# EAGLE design Day0_DafaFarisM_13215044 (EAGLE 7.6.0)
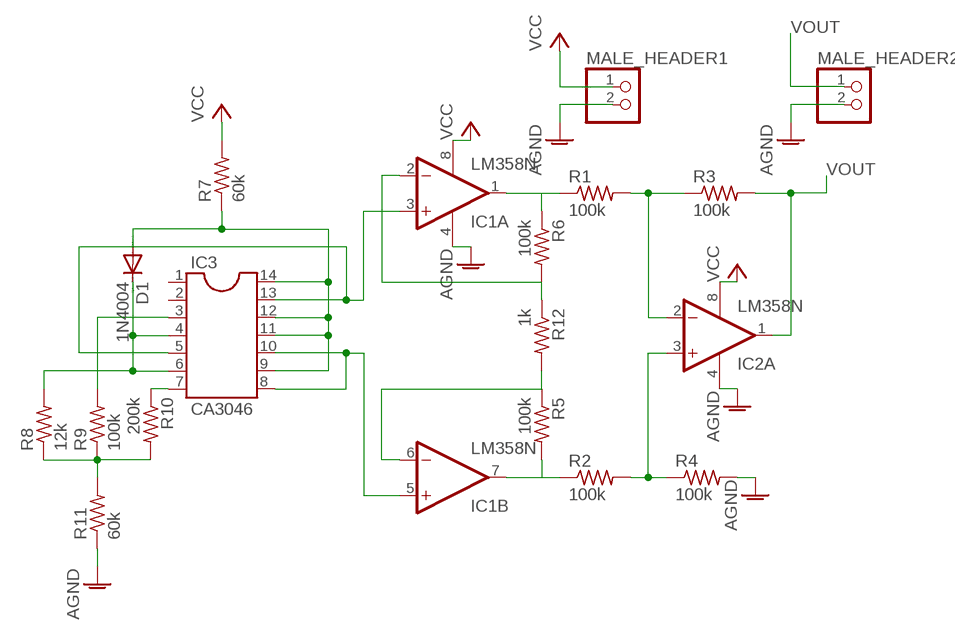
[diagram p0: schematic, sheet 1]

## Parts
D1  1N4004  [DO41-10]
IC1  LM358N  [DIL08]
IC2  LM358N  [DIL08]
IC3  CA3046  DIL14  [DIL14]
MALE_HEADER1  PINHD-1X2  [1X02]
MALE_HEADER2  PINHD-1X2  [1X02]
R1  100k  R-US_0204/2V  [0204V]
R2  100k  R-US_0204/2V  [0204V]
R3  100k  R-US_0204/2V  [0204V]
R4  100k  R-US_0204/2V  [0204V]
R5  100k  R-US_0204/2V  [0204V]
R6  100k  R-US_0204/2V  [0204V]
R7  60k  R-US_0204/2V  [0204V]
R8  12k  R-US_0204/2V  [0204V]
R9  100k  R-US_0204/2V  [0204V]
R10  200k  R-US_0204/2V  [0204V]
R11  60k  R-US_0204/2V  [0204V]
R12  1k  R-US_0204/2V  [0204V]

## Nets
AGND: IC1.4(P:V-) IC2.4(P:V-) MALE_HEADER1.2 MALE_HEADER2.2 R4.2 R11.1
N$1: D1.A IC3.9 IC3.11 IC3.12 IC3.14 R7.1
N$2: D1.C IC3.4 IC3.6 R8.2
N$3: IC3.7 R10.1
N$4: IC3.3 R9.2
N$5: IC1.3(A:+IN) IC3.5 IC3.13
N$6: IC1.5(B:+IN) IC3.8 IC3.10
N$7: R8.1 R9.1 R10.2 R11.2
N$8: IC1.2(A:-IN) R6.2 R12.1
N$9: IC1.1(A:OUT) R1.1 R6.1
N$10: IC2.2(A:-IN) R1.2 R3.1
N$11: IC1.6(B:-IN) R5.1 R12.2
N$13: IC1.7(B:OUT) R2.1 R5.2
N$14: IC2.3(A:+IN) R2.2 R4.1
VCC: IC1.8(P:V+) IC2.8(P:V+) MALE_HEADER1.1 R7.2
VOUT: IC2.1(A:OUT) MALE_HEADER2.1 R3.2
Unconnected: IC2.5(B:+IN) IC2.6(B:-IN) IC2.7(B:OUT) IC3.1 IC3.2

## Library data of the parts
D1 = diode:1N4004: DIODE general purpose rectifier, 1 A
IC1 IC2 = linear:LM358: OP AMP also LM158; LM258; LM2904 Source: http://cache.national.com/ds/LM/LM158.pdf
IC3 = ic-package:DIL14: Dual In Line / Socket
MALE_HEADER1 MALE_HEADER2 = pinhead:PINHD-1X2: PIN HEADER
R1-R12 = rcl:R-US_: RESISTOR, American symbol

## Board
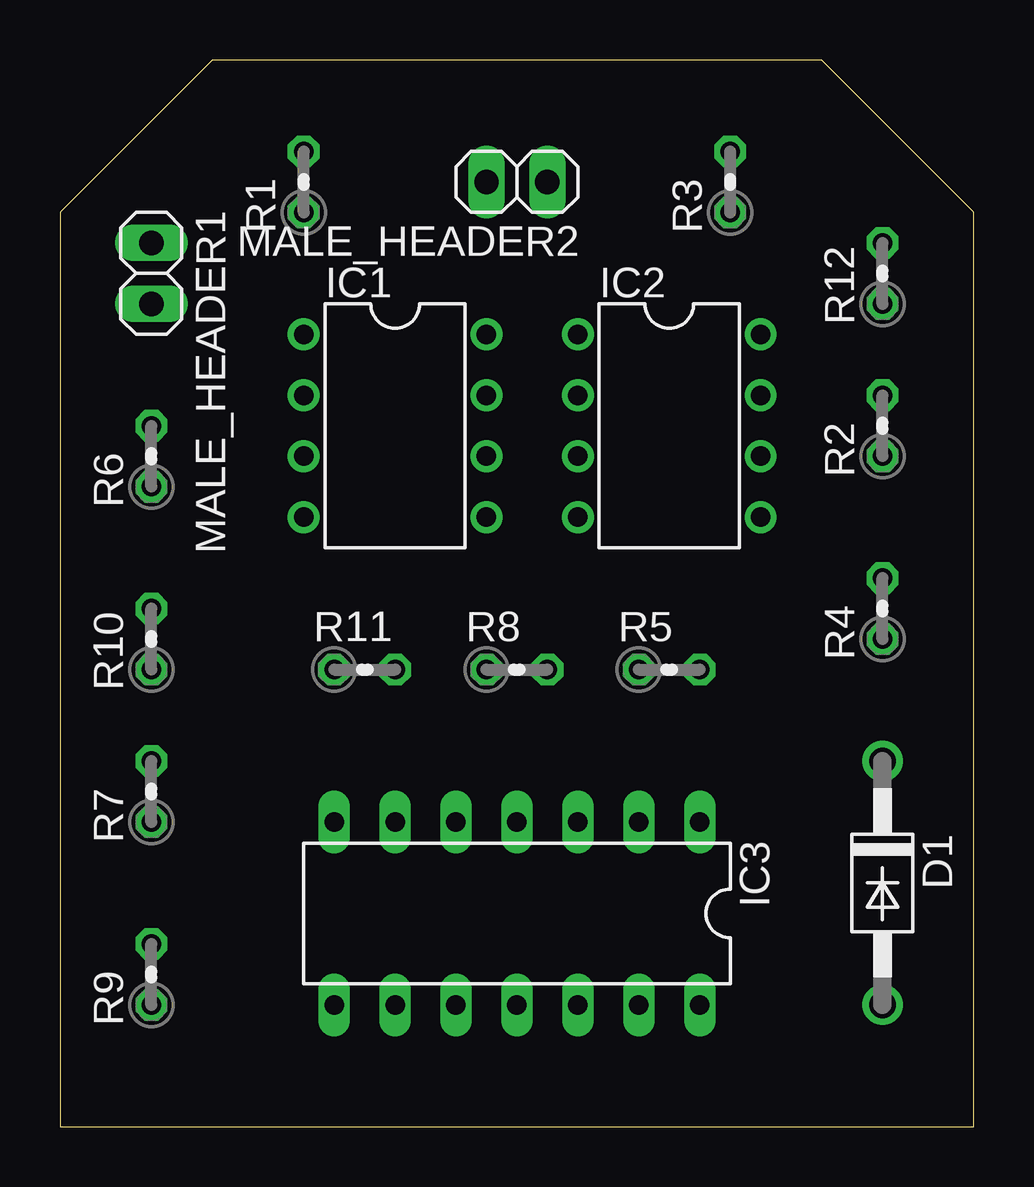
[diagram p1: board, top side]
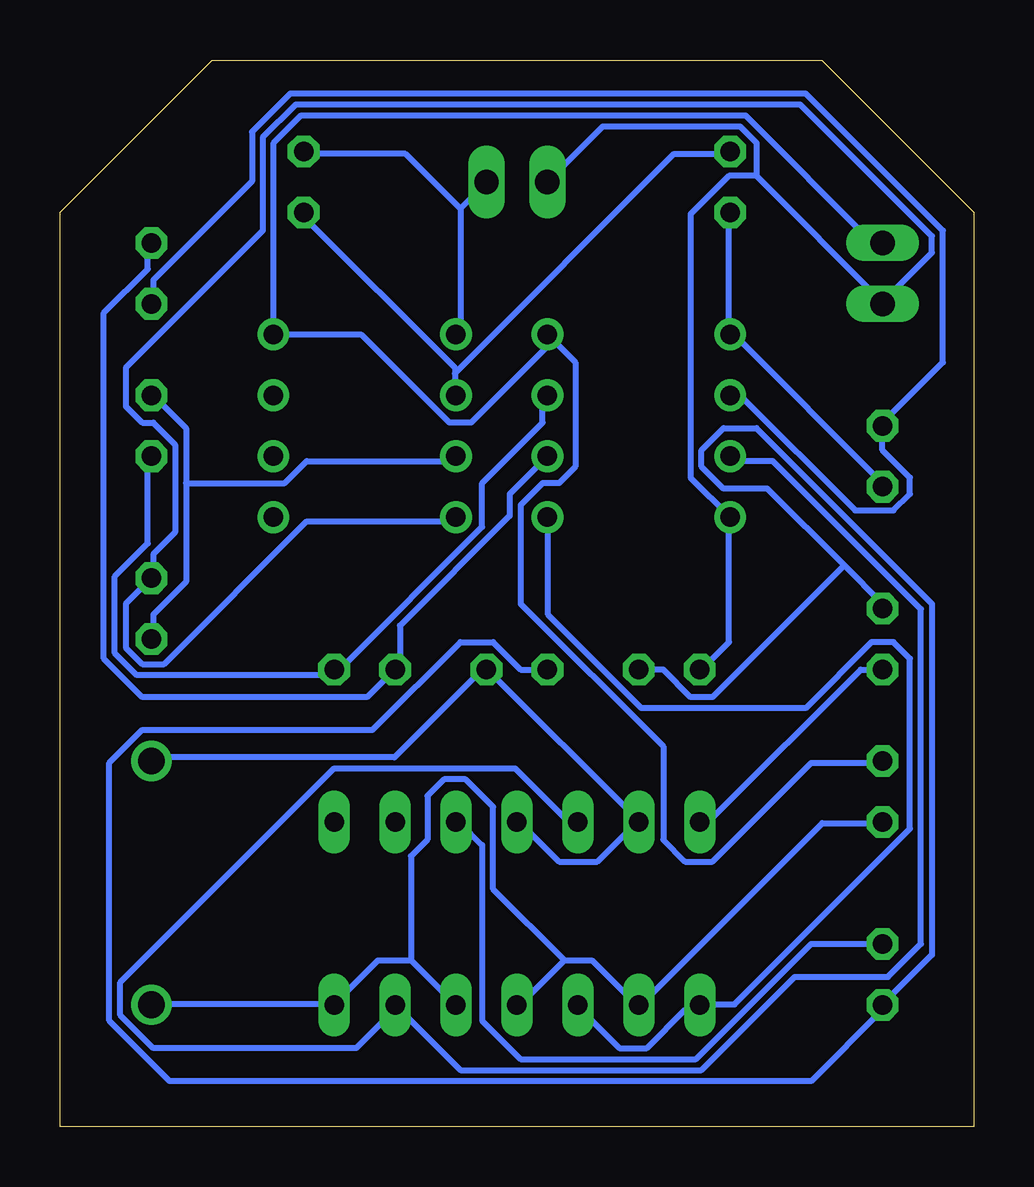
[diagram p2: board, bottom side, seen from below]

Size 38.1 x 44.45 mm. Coordinates in mm from the lower left corner, seen from the top.
Outline: 0,0 38.1,0 38.1,38.1 31.76,44.44 30.15,44.44 6.35,44.45 0,38.1 0,0
Copper layers (1*16): Top 0.035mm / dielectric 1.5mm / Bottom 0.035mm
Design rules "default": minimum track width 10mil, minimum drill 24mil, track to track 8mil, track to pad 8mil, pad to pad 8mil, via to via 8mil, smd to smd 8mil, copper to edge 40mil, drill to drill 8mil, minimum pad ring 10mil, minimum via ring 8mil, stop-mask expansion 4mil, vias tented up to drill 0mil, thermal gap 10mil

### Footprints (pad centres in the part's own frame; a part is rotated, then mirrored left to right if it is on the bottom)
DO41-10 = drill 1.118: A 5.08,0; C -5.08,0
DIL08 = drill 0.813 pad 1.27: 1 -3.81,-3.81; 2 -1.27,-3.81; 3 1.27,-3.81; 4 3.81,-3.81; 5 3.81,3.81; 6 1.27,3.81; 7 -1.27,3.81; 8 -3.81,3.81
DIL14 = drill 0.813 long: 1 -7.62,-3.81; 2 -5.08,-3.81; 3 -2.54,-3.81; 4 0,-3.81; 5 2.54,-3.81; 6 5.08,-3.81; 7 7.62,-3.81; 8 7.62,3.81; 9 5.08,3.81; 10 2.54,3.81; 11 0,3.81; 12 -2.54,3.81; 13 -5.08,3.81; 14 -7.62,3.81
1X02 = drill 1.016 long: 1 -1.27,0; 2 1.27,0
0204V = drill 0.813 octagon: 1 -1.27,0; 2 1.27,0

### Placement (x,y rotation side)
D1  34.29,10.16 270 top
IC1  13.97,29.21 270 top
IC2  25.4,29.21 270 top
IC3  19.05,8.89 180 top
MALE_HEADER1  3.81,35.56 270 top
MALE_HEADER2  19.05,39.37 180 top
R1  10.16,39.37 90 top
R2  34.29,29.21 90 top
R3  27.94,39.37 90 top
R4  34.29,21.59 90 top
R5  25.4,19.05 0 top
R6  3.81,27.94 90 top
R7  3.81,13.97 90 top
R8  19.05,19.05 0 top
R9  3.81,6.35 90 top
R10  3.81,20.32 90 top
R11  12.7,19.05 0 top
R12  34.29,35.56 90 top

### Tracks (layer width: path | path; a pad name or v marks a point on that pad's centre or on a via)
AGND
  Bottom 0.254: IC2.4 21.64,25.22 27.81,25.22 33.76,19.28 34.67,19.28 35.36,19.96 35.36,21.79 R4.2 34.21,22.94 34.21,23.85 33.3,24.77 33.3,28.42 34.21,29.34 34.67,29.34 35.36,30.02 35.36,31.62 29.64,37.34 29.64,41.22 28.27,42.6 7.24,42.6 1.75,37.11 1.75,36.42 3.81,34.37 | R11.1 11.35,19.05 10.21,20.19 10.21,25.22 IC1.4 11.81,27.05 11.81,38.02 10.21,39.62 9.07,39.62 | 9.07,39.62 3.81,34.37 | 9.07,39.62 9.07,41 9.75,41.68 15.47,41.68 MALE_HEADER2.2 | 3.81,34.37 MALE_HEADER1.2
N$1
  Bottom 0.254: 23.47,6.93 21.64,5.1 IC3.12 | 23.47,6.93 24.84,6.93 26.67,5.1 | 26.67,5.1 34.21,5.1 D1.A | 26.67,5.1 IC3.14 | 17.07,6.93 15.93,6.93 14.1,5.1 IC3.9 13.87,5.1 6.32,12.65 3.81,12.65 R7.1 | 17.07,6.93 18.9,5.1 IC3.11 | 23.47,6.93 23.47,11.28 22.78,11.96 22.78,13.79 22.1,14.48 21.18,14.48 20.04,13.33 20.04,9.91 17.07,6.93
N$2
  Bottom 0.254: IC3.4 18.9,12.65 17.3,11.05 15.7,11.05 14.1,12.65 IC3.6 14.1,12.88 20.27,19.05 R8.2 20.5,19.05 24.15,15.39 34.21,15.39 D1.C
N$3
  Bottom 0.254: R10.1 4.72,19.05 10.9,12.88 11.35,12.88 IC3.7
N$4
  Bottom 0.254: R9.2 6.78,7.62 11.58,2.82 18.9,2.82 20.5,4.42 20.5,11.73 21.41,12.65 IC3.3
N$5
  Bottom 0.254: IC3.5 16.61,12.88 17.07,12.88 19.13,14.94 26.67,14.94 35.58,6.02 35.58,4.65 34.21,3.28 25.76,3.28 24.15,4.88 IC3.13 21.41,2.36 11.35,2.36 7.47,6.25 3.58,6.25 2.21,7.62 2.21,21.57 8.38,27.74 9.98,27.74 IC1.3
N$6
  Bottom 0.254: IC3.10 16.38,4.88 14.78,3.28 13.64,3.28 12.04,4.88 11.58,4.88 IC3.8 11.35,5.1 9.98,5.1 2.67,12.42 2.67,19.51 3.35,20.19 4.27,20.19 7.01,17.45 13.87,17.45 17.75,21.34 17.75,25.22 IC1.5
N$7
  Bottom 0.254: 5.41,23.39 3.81,21.79 R10.2 | 5.41,23.39 8.61,26.59 10.44,26.59 11.35,27.51 11.35,28.19 10.44,29.11 9.07,29.11 1.75,21.79 1.75,7.16 3.81,5.1 R9.1 3.81,4.88 6.78,1.9 33.53,1.9 36.04,4.42 36.04,15.16 34.67,16.54 25.07,16.54 21.41,20.19 20.04,20.19 18.9,19.05 R8.1 | R11.2 12.95,19.05 11.81,17.91 10.9,17.91 5.41,23.39
N$8
  Bottom 0.254: IC1.2 9.75,30.48 4.95,25.68 3.35,25.68 2.67,26.37 2.67,27.05 3.81,28.19 R6.2 3.81,29.34 1.29,31.85 1.29,37.34 7.01,43.05 28.5,43.05 30.1,41.45 30.1,39.39 34.21,35.28 34.21,34.37 R12.1
N$9
  Bottom 0.254: R6.1 3.81,26.82 9.98,32.99 IC1.1 10.21,33.22 10.21,38.02 R1.1
N$10
  Bottom 0.254: 21.64,31.39 21.64,31.62 28.04,38.02 R3.1 | 21.64,31.39 21.64,30.48 IC2.2 | 21.64,31.39 12.5,40.54 10.21,40.54 R1.2
N$11
  Bottom 0.254: IC1.6 19.36,26.37 19.36,25.45 23.93,20.88 23.93,19.05 R5.1 24.15,19.05 25.3,17.91 34.67,17.91 36.27,19.51 36.27,33.91 34.44,35.74 34.44,36.65 R12.2
N$13
  Bottom 0.254: IC1.7 17.98,30.48 17.98,29.34 20.5,26.82 20.5,24.99 26.44,19.05 R5.2 26.9,18.82 34.9,18.82 35.81,19.74 35.81,22.94 34.44,24.31 34.44,27.74 R2.1
N$14
  Bottom 0.254: 32.84,26.82 32.84,29.11 34.21,30.48 R2.2 | 32.84,26.82 32.84,22.71 34.21,21.34 34.21,20.42 R4.1 | 32.84,26.82 28.73,26.82 27.81,27.74 21.64,27.74 IC2.3
VCC
  Bottom 0.254: 17.53,32.77 IC1.8 17.75,32.99 | 17.53,32.77 16.61,31.85 16.61,27.51 17.3,26.82 17.98,26.82 18.9,25.91 18.9,21.79 12.95,15.85 12.95,11.96 12.04,11.05 10.9,11.05 6.78,15.16 3.81,15.16 R7.2 | 17.53,32.77 20.96,29.34 21.87,29.34 25.53,32.99 29.18,32.99 IC2.8 29.18,33.22 29.18,41 28.04,42.14 9.53,42.14 4.27,36.88 3.81,36.88 MALE_HEADER1.1
VOUT
  Bottom 0.254: 21.41,38.25 21.41,33.22 IC2.1 | 21.41,38.25 20.5,39.17 MALE_HEADER2.1 | 21.41,38.25 23.7,40.54 27.81,40.54 R3.2